# Altium schematic sheet STM32.SchDoc
size A3 portrait; SheetNumber: 6; SheetTotal: 6
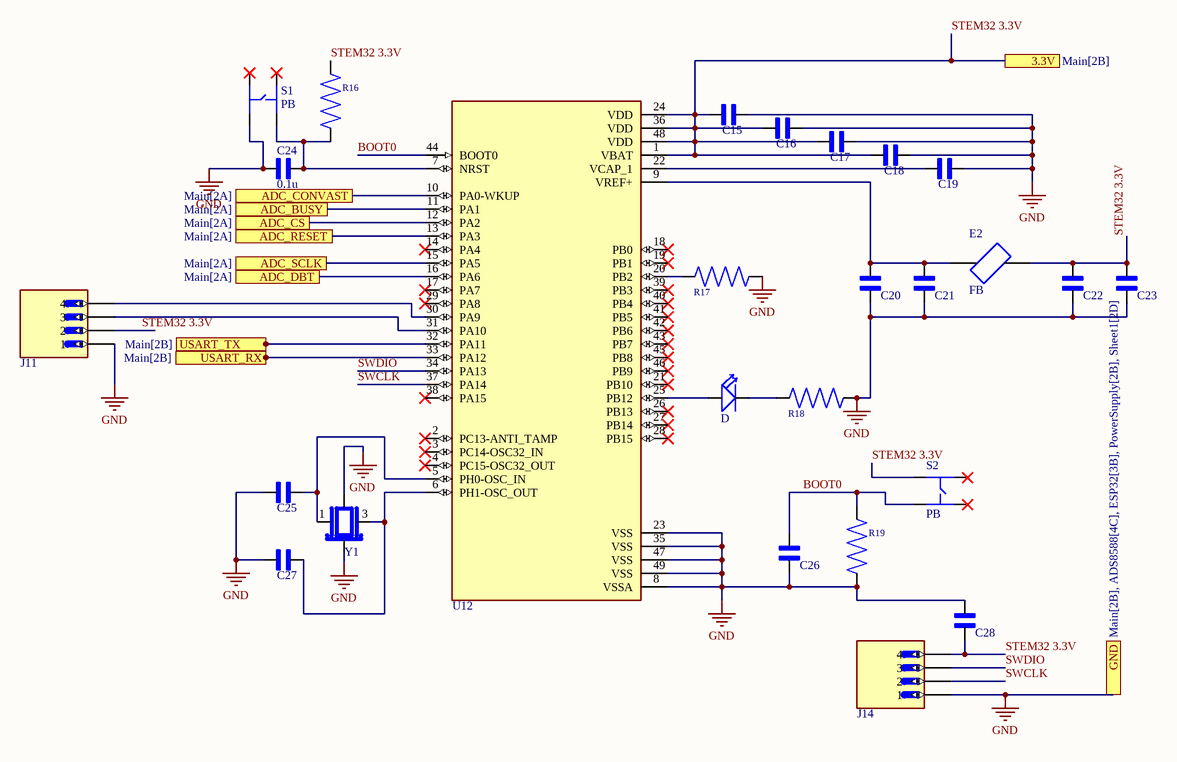
[diagram p0: STM32.SchDoc]

## Parts
C15  CAP603  [CAP603]  (value not drawn)
C16  CAP603  [CAP603]  (value not drawn)
C17  CAP603  [CAP603]  (value not drawn)
C18  CAP603  [CAP603]  (value not drawn)
C19  CAP603  [CAP603]  (value not drawn)
C20  CAP603  [CAP603]  (value not drawn)
C21  CAP603  [CAP603]  (value not drawn)
C22  CAP603  [CAP603]  (value not drawn)
C23  CAP603  [CAP603]  (value not drawn)
C24  0.1u  [0603Capacitor]
C25  CAP603  [CAP603]  (value not drawn)
C26  CAP603  [CAP603]  (value not drawn)
C27  CAP603  [CAP603]  (value not drawn)
C28  CAP603  [CAP603]  (value not drawn)
D  SMD-LED-YELLOW-WHITE(0603)  [LED-0603]  (value not drawn)
E2  FB  [FB_MI1206K601R-10]
J11  4-pin header  [4-pin header]  (value not drawn)
J14  4-pin header  [4-pin header]  (value not drawn)
R16  RES-603  [CAP603]  (value not drawn)
R17  RES-603  [CAP603]  (value not drawn)
R18  RES-603  [CAP603]  (value not drawn)
R19  RES-603  [CAP603]  (value not drawn)
S1  PB  [Push_button]
S2  PB  [Push_button]
U12  STM32F411CEU6TR  [STM32F411CEU6TR]  (value not drawn)
Y1  25 MHz oscillator  [25 MHz oscillator]  (value not drawn)

## Ports
3.3V (see Main[2B]), ADC_BUSY (see Main[2A]), ADC_CONVAST (see Main[2A]), ADC_CS (see Main[2A]), ADC_DBT (see Main[2A]), ADC_RESET (see Main[2A]), ADC_SCLK (see Main[2A]), GND (see Main[2B], ADS8588[4C], ESP32[3B], PowerSupply[2B], Sheet1[2D]), USART_RX (see Main[2B]), USART_TX (see Main[2B])

## Nets
GND: C15.2 C16.2 C17.2 C18.2 C19.2 C20.1 C21.1 C22.1 C23.1 C24.1 C25.1 C26.1 C27.1 C28.2 J11.1 J14.1 R17.2 R18.2 R19.1 S1.1 U12.8(VSSA) U12.23(VSS) U12.35(VSS) U12.47(VSS) U12.49(VSS) Y1.2(GND) Y1.4(GND) ; port GND
ADC_BUSY: U12.11(PA1) ; port ADC_BUSY
ADC_CONVAST: U12.10(PA0-WKUP) ; port ADC_CONVAST
ADC_CS: U12.12(PA2) ; port ADC_CS
ADC_DBT: U12.16(PA6) ; port ADC_DBT
ADC_RESET: U12.13(PA3) ; port ADC_RESET
ADC_SCLK: U12.15(PA5) ; port ADC_SCLK
BOOT0: C26.2 R19.2 S2.3 U12.44(BOOT0)
STEM32 3.3V: C15.1 C16.1 C17.1 C18.1 C22.2 C23.2 C28.1 E2.2 J11.2 J14.4 R16.2 S2.1 U12.1(VBAT) U12.24(VDD) U12.36(VDD) U12.48(VDD) ; port 3.3V
SWCLK: J14.2 U12.37(PA14)
SWDIO: J14.3 U12.34(PA13)
USART_RX: U12.33(PA12) ; port USART_RX
USART_TX: U12.32(PA11) ; port USART_TX
NetC19_1: C19.1 U12.22(VCAP_1)
NetC20_2: C20.2 C21.2 E2.1 U12.9(VREF+)
NetC24_2: C24.2 R16.1 S1.3 U12.7(NRST)
NetC25_2: C25.2 U12.5(PH0-OSC_IN) Y1.1
NetC27_2: C27.2 U12.6(PH1-OSC_OUT) Y1.3
NetD_NEG: D.NEG R18.1
NetD_POS: D.POS U12.25(PB12)
NetJ11_3: J11.3 U12.31(PA10)
NetJ11_4: J11.4 U12.30(PA9)
NetR17_1: R17.1 U12.20(PB2)

Not connected (* = marked no-connect by the designer): S1 2* 4; S2 2* 4; U12 2(PC13-ANTI_TAMP)* 3(PC14-OSC32_IN)* 4(PC15-OSC32_OUT)* 14(PA4)* 17(PA7)* 18(PB0)* 19(PB1)* 21(PB10)* 26(PB13)* 27(PB14)* 28(PB15)* 29(PA8)* 38(PA15)* 39(PB3)* 40(PB4)* 41(PB5)* 42(PB6)* 43(PB7)* 45(PB8)* 46(PB9)*

## Notes on the sheet
- Title
- Size:
- Date:
- A3
- Number:
- Time:
- Revision:
- Sheet
- of
- File:

## Library data of the parts
C15-C23 C25-C28 = CAP603: 0.1 ÂµF Â±5% 10V Ceramic Capacitor X7R 0603 (1608 Metric); MF: Vishay; MP: VJ0603Y104JXQCW1BC; SnapEDA_Link: https://www.snapeda.com/parts/VJ0603Y104JXQCW1BC/Vishay/view-part/?ref=snap; Package: 0603-2 VISHAY; Value: *; Check_prices: https://www.snapeda.com/parts/VJ0603Y104JXQCW1BC/Vishay/view-part/?ref=eda
C24 = 0603_0.1u: 100nf,X7R,50V; MF: AVX; MP: 0603YC223KAT2A; SnapEDA_Link: https://www.snapeda.com/parts/0603YC223KAT2A/AVX/view-part/?ref=snap; Package: 1608 AVX; Value: *; Check_prices: https://www.snapeda.com/parts/0603YC223KAT2A/AVX/view-part/?ref=eda
D = SMD-LED-YELLOW-WHITE(0603): SMD LED Yellow-White; MF: Chengguangxing; MP: ADL-0603W; SnapEDA_Link: https://www.snapeda.com/parts/ADL-0603W/Chengguangxing/view-part/106378/?ref=snap; Availability: Unavailable; Value: *; Price: None; Package: None
E2 = MI1206K601R-10: 600 Ohms @ 100 MHz 1 Power, Signal Line Ferrite Bead 1206 (3216 Metric) 1.5A 80mOhm; MF: Laird-Signal Integrity; SnapEDA_Link: https://www.snapeda.com/parts/MI1206K601R-10/Laird-Signal+Integrity+Products/view-part/?ref=snap; Package: 1206 Laird; Value: *; MP: MI1206K601R-10; Check_prices: https://www.snapeda.com/parts/MI1206K601R-10/Laird-Signal+Integrity+Products/view-part/?ref=eda
J11 J14 = 4-pin header: BergStikÂ®, Board to Board connector, Unshrouded Header, Through Hole, Single Row, 4 Positions, 2.54 mm Pitch, Vertical, 5.84 mm (0.23 in.) Mating, 2.41 mm (0.095 in.) Tail; MF: FCI; MP: 68000-104HLF; SnapEDA_Link: https://www.snapeda.com/parts/68000-104HLF/Amphenol+FCI/view-part/?ref=snap; Package: None; Value: *; Check_prices: https://www.snapeda.com/parts/68000-104HLF/Amphenol+FCI/view-part/?ref=eda
R16-R19 = RES-603: MF: Yageo; MP: RC0805FR-0710KL; Value: *; SnapEDA_Link: https://www.snapeda.com/parts/RC0805FR-0710KL/Yageo/view-part/?ref=snap; Purchase-URL: https://pricing.snapeda.com/search/part/RC0805FR-0710KL/?ref=eda; Availability: In Stock; Price: None; Package: 2012 Rohm Semiconductor; Check_prices: https://www.snapeda.com/parts/RC0805FR-0710KL/Yageo/view-part/?ref=eda
S1 S2 = PushButton
U12 = STM32F411CEU6TR: ARMÂ® CortexÂ®-M4 series Microcontroller IC 32-Bit Single-Core 100MHz 512KB (512K x 8) FLASH 48-UFQFPN (7x7); MF: STMicroelectronics; Value: *; MP: STM32F411CEU6TR; Package: UFQFN-48 STMicroelectronics; Availability: In Stock; Price: None; SnapEDA_Link: https://www.snapeda.com/parts/STM32F411CEU6TR/STMicroelectronics/view-part/?ref=snap; Check_prices: https://www.snapeda.com/parts/STM32F411CEU6TR/STMicroelectronics/view-part/?ref=eda; Purchase-URL: https://pricing.snapeda.com/search/part/STM32F411CEU6TR/?ref=eda
Y1 = 25 MHz oscillator: 25 MHz 10ppm Crystal 18pF 30 Ohms 4-SMD, No Lead (3.20mm x 2.50mm); MF: Raltron Electronics; MP: RH100-25.000-18-F-1015-TR-NS2; SnapEDA_Link: https://www.snapeda.com/parts/RH100-25.000-18-F-1015-TR-NS2/Raltron+Electronics/view-part/?ref=snap; Package: None; Value: *; Check_prices: https://www.snapeda.com/parts/RH100-25.000-18-F-1015-TR-NS2/Raltron+Electronics/view-part/?ref=eda